# Altium project carrier.PrjPcb (part 2 of 2)

## Sheet connectors.SchDoc: DevelBoard EVA01 Main Connectors
size A3; Author: Daniele Basile <asterix@develer.com>; Organization: Develer s.r.l.; Address1: via Mugellese 1/A; Address2: 50019 Campi Bisenzio; Address3: Firenze; Address4: ITALY; DocumentNumber: 1; Revision: A; SheetNumber: 1; SheetTotal: 6
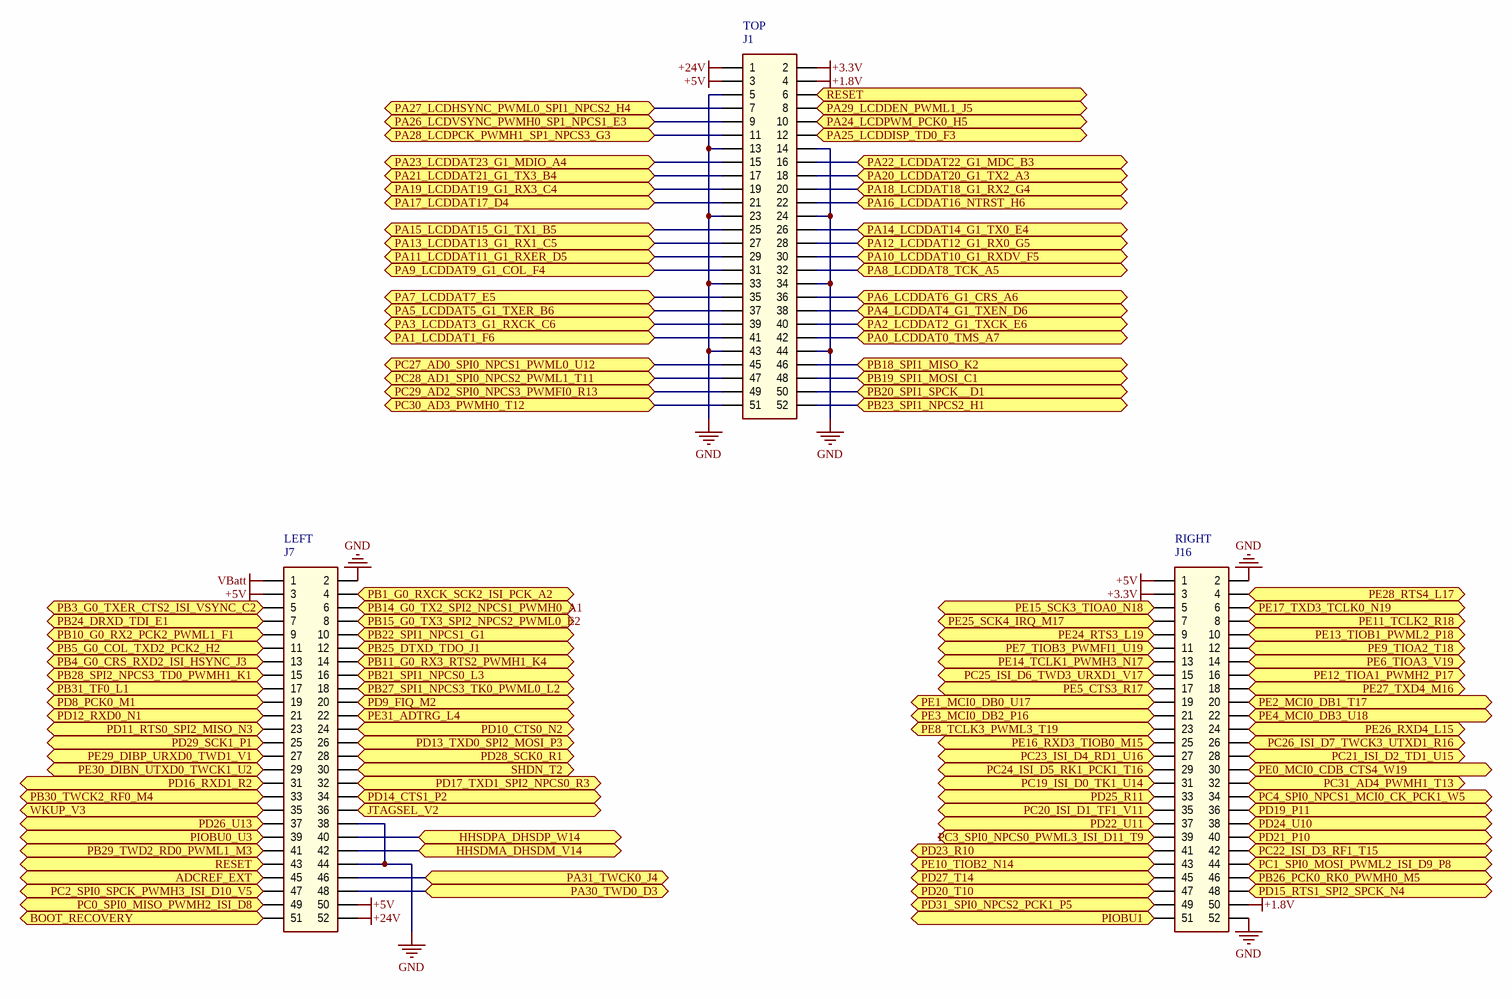
[diagram p5: connectors.SchDoc]

### Parts
J1  TOP  [HEADER_2x26_2.54MM_SMD]
J7  LEFT  [HEADER_2x26_2.54MM_SMD]
J16  RIGHT  [HEADER_2x26_2.54MM_SMD]

### Ports
ADCREF_EXT, BOOT_RECOVERY, HHSDMA_DHSDM_V14, HHSDPA_DHSDP_W14, JTAGSEL_V2, PA0_LCDDAT0_TMS_A7, PA1_LCDDAT1_F6, PA2_LCDDAT2_G1_TXCK_E6, PA3_LCDDAT3_G1_RXCK_C6, PA4_LCDDAT4_G1_TXEN_D6, PA5_LCDDAT5_G1_TXER_B6, PA6_LCDDAT6_G1_CRS_A6, PA7_LCDDAT7_E5, PA8_LCDDAT8_TCK_A5, PA9_LCDDAT9_G1_COL_F4, PA10_LCDDAT10_G1_RXDV_F5, PA11_LCDDAT11_G1_RXER_D5, PA12_LCDDAT12_G1_RX0_G5, PA13_LCDDAT13_G1_RX1_C5, PA14_LCDDAT14_G1_TX0_E4, PA15_LCDDAT15_G1_TX1_B5, PA16_LCDDAT16_NTRST_H6, PA17_LCDDAT17_D4, PA18_LCDDAT18_G1_RX2_G4, PA19_LCDDAT19_G1_RX3_C4, PA20_LCDDAT20_G1_TX2_A3, PA21_LCDDAT21_G1_TX3_B4, PA22_LCDDAT22_G1_MDC_B3, PA23_LCDDAT23_G1_MDIO_A4, PA24_LCDPWM_PCK0_H5, PA25_LCDDISP_TD0_F3, PA26_LCDVSYNC_PWMH0_SP1_NPCS1_E3, PA27_LCDHSYNC_PWML0_SPI1_NPCS2_H4, PA28_LCDPCK_PWMH1_SP1_NPCS3_G3, PA29_LCDDEN_PWML1_J5, PA30_TWD0_D3, PA31_TWCK0_J4, PB1_G0_RXCK_SCK2_ISI_PCK_A2, PB3_G0_TXER_CTS2_ISI_VSYNC_C2, PB4_G0_CRS_RXD2_ISI_HSYNC_J3, PB5_G0_COL_TXD2_PCK2_H2, PB10_G0_RX2_PCK2_PWML1_F1, PB11_G0_RX3_RTS2_PWMH1_K4, PB14_G0_TX2_SPI2_NPCS1_PWMH0_A1, PB15_G0_TX3_SPI2_NPCS2_PWML0_E2, PB18_SPI1_MISO_K2, PB19_SPI1_MOSI_C1, PB20_SPI1_SPCK__D1, PB21_SPI1_NPCS0_L3, PB22_SPI1_NPCS1_G1, PB23_SPI1_NPCS2_H1, PB24_DRXD_TDI_E1, PB25_DTXD_TDO_J1, PB26_PCK0_RK0_PWMH0_M5, PB27_SPI1_NPCS3_TK0_PWML0_L2, PB28_SPI2_NPCS3_TD0_PWMH1_K1, PB29_TWD2_RD0_PWML1_M3, PB30_TWCK2_RF0_M4, PB31_TF0_L1, PC0_SPI0_MISO_PWMH2_ISI_D8, PC1_SPI0_MOSI_PWML2_ISI_D9_P8, PC2_SPI0_SPCK_PWMH3_ISI_D10_V5, PC3_SPI0_NPCS0_PWML3_ISI_D11_T9, PC4_SPI0_NPCS1_MCI0_CK_PCK1_W5, PC19_ISI_D0_TK1_U14, PC20_ISI_D1_TF1_V11, PC21_ISI_D2_TD1_U15, PC22_ISI_D3_RF1_T15, PC23_ISI_D4_RD1_U16, PC24_ISI_D5_RK1_PCK1_T16, PC25_ISI_D6_TWD3_URXD1_V17, PC26_ISI_D7_TWCK3_UTXD1_R16, PC27_AD0_SPI0_NPCS1_PWML0_U12, PC28_AD1_SPI0_NPCS2_PWML1_T11, PC29_AD2_SPI0_NPCS3_PWMFI0_R13, PC30_AD3_PWMH0_T12, PC31_AD4_PWMH1_T13, PD8_PCK0_M1, PD9_FIQ_M2, PD10_CTS0_N2, PD11_RTS0_SPI2_MISO_N3, PD12_RXD0_N1, PD13_TXD0_SPI2_MOSI_P3, PD14_CTS1_P2, PD15_RTS1_SPI2_SPCK_N4, PD16_RXD1_R2, PD17_TXD1_SPI2_NPCS0_R3, PD19_P11, PD20_T10, PD21_P10, PD22_U11, PD23_R10, PD24_U10, PD25_R11, PD26_U13, PD27_T14, PD28_SCK0_R1, PD29_SCK1_P1, PD31_SPI0_NPCS2_PCK1_P5, PE0_MCI0_CDB_CTS4_W19, PE1_MCI0_DB0_U17, PE2_MCI0_DB1_T17, PE3_MCI0_DB2_P16, PE4_MCI0_DB3_U18, PE5_CTS3_R17, PE6_TIOA3_V19, PE7_TIOB3_PWMFI1_U19, PE8_TCLK3_PWML3_T19, PE9_TIOA2_T18, PE10_TIOB2_N14, PE11_TCLK2_R18, PE12_TIOA1_PWMH2_P17, PE13_TIOB1_PWML2_P18, PE14_TCLK1_PWMH3_N17, PE15_SCK3_TIOA0_N18, PE16_RXD3_TIOB0_M15, PE17_TXD3_TCLK0_N19, PE24_RTS3_L19, PE25_SCK4_IRQ_M17, PE26_RXD4_L15, PE27_TXD4_M16, PE28_RTS4_L17, PE29_DIBP_URXD0_TWD1_V1, PE30_DIBN_UTXD0_TWCK1_U2, PE31_ADTRG_L4, PIOBU0_U3, PIOBU1, RESET, SHDN_T2, WKUP_V3

### Nets
+1.8V: J1.4 J16.50
+3.3V: J1.2 J16.3
+5V: J1.3 J7.3 J7.50 J16.1
+24V: J1.1 J7.52
GND: J1.5 J1.13 J1.14 J1.23 J1.24 J1.33 J1.34 J1.43 J1.44 J7.2 J7.38 J7.44 J16.2 J16.52
VBatt: J7.1
ADCREF_EXT: J7.45 ; port ADCREF_EXT
BOOT_RECOVERY: J7.51 ; port BOOT_RECOVERY
JTAGSEL_V2: J7.36 ; port JTAGSEL_V2
PA0_LCDDAT0_TMS_A7: J1.42 ; port PA0_LCDDAT0_TMS_A7
PA1_LCDDAT1_F6: J1.41 ; port PA1_LCDDAT1_F6
PA2_LCDDAT2_G1_TXCK_E6: J1.40 ; port PA2_LCDDAT2_G1_TXCK_E6
PA3_LCDDAT3_G1_RXCK_C6: J1.39 ; port PA3_LCDDAT3_G1_RXCK_C6
PA4_LCDDAT4_G1_TXEN_D6: J1.38 ; port PA4_LCDDAT4_G1_TXEN_D6
PA5_LCDDAT5_G1_TXER_B6: J1.37 ; port PA5_LCDDAT5_G1_TXER_B6
PA6_LCDDAT6_G1_CRS_A6: J1.36 ; port PA6_LCDDAT6_G1_CRS_A6
PA7_LCDDAT7_E5: J1.35 ; port PA7_LCDDAT7_E5
PA8_LCDDAT8_TCK_A5: J1.32 ; port PA8_LCDDAT8_TCK_A5
PA9_LCDDAT9_G1_COL_F4: J1.31 ; port PA9_LCDDAT9_G1_COL_F4
PA10_LCDDAT10_G1_RXDV_F5: J1.30 ; port PA10_LCDDAT10_G1_RXDV_F5
PA11_LCDDAT11_G1_RXER_D5: J1.29 ; port PA11_LCDDAT11_G1_RXER_D5
PA12_LCDDAT12_G1_RX0_G5: J1.28 ; port PA12_LCDDAT12_G1_RX0_G5
PA13_LCDDAT13_G1_RX1_C5: J1.27 ; port PA13_LCDDAT13_G1_RX1_C5
PA14_LCDDAT14_G1_TX0_E4: J1.26 ; port PA14_LCDDAT14_G1_TX0_E4
PA15_LCDDAT15_G1_TX1_B5: J1.25 ; port PA15_LCDDAT15_G1_TX1_B5
PA16_LCDDAT16_NTRST_H6: J1.22 ; port PA16_LCDDAT16_NTRST_H6
PA17_LCDDAT17_D4: J1.21 ; port PA17_LCDDAT17_D4
PA18_LCDDAT18_G1_RX2_G4: J1.20 ; port PA18_LCDDAT18_G1_RX2_G4
PA19_LCDDAT19_G1_RX3_C4: J1.19 ; port PA19_LCDDAT19_G1_RX3_C4
PA20_LCDDAT20_G1_TX2_A3: J1.18 ; port PA20_LCDDAT20_G1_TX2_A3
PA21_LCDDAT21_G1_TX3_B4: J1.17 ; port PA21_LCDDAT21_G1_TX3_B4
PA22_LCDDAT22_G1_MDC_B3: J1.16 ; port PA22_LCDDAT22_G1_MDC_B3
PA23_LCDDAT23_G1_MDIO_A4: J1.15 ; port PA23_LCDDAT23_G1_MDIO_A4
PA24_LCDPWM_PCK0_H5: J1.10 ; port PA24_LCDPWM_PCK0_H5
PA25_LCDDISP_TD0_F3: J1.12 ; port PA25_LCDDISP_TD0_F3
PA26_LCDVSYNC_PWMH0_SP1_NPCS1_E3: J1.9 ; port PA26_LCDVSYNC_PWMH0_SP1_NPCS1_E3
PA27_LCDHSYNC_PWML0_SPI1_NPCS2_H4: J1.7 ; port PA27_LCDHSYNC_PWML0_SPI1_NPCS2_H4
PA28_LCDPCK_PWMH1_SP1_NPCS3_G3: J1.11 ; port PA28_LCDPCK_PWMH1_SP1_NPCS3_G3
PA29_LCDDEN_PWML1_J5: J1.8 ; port PA29_LCDDEN_PWML1_J5
PA30_TWD0_D3: J7.48 ; port PA30_TWD0_D3
PA31_TWCK0_J4: J7.46 ; port PA31_TWCK0_J4
PB1_G0_RXCK_SCK2_ISI_PCK_A2: J7.4 ; port PB1_G0_RXCK_SCK2_ISI_PCK_A2
PB3_G0_TXER_CTS2_ISI_VSYNC_C2: J7.5 ; port PB3_G0_TXER_CTS2_ISI_VSYNC_C2
PB4_G0_CRS_RXD2_ISI_HSYNC_J3: J7.13 ; port PB4_G0_CRS_RXD2_ISI_HSYNC_J3
PB5_G0_COL_TXD2_PCK2_H2: J7.11 ; port PB5_G0_COL_TXD2_PCK2_H2
PB10_G0_RX2_PCK2_PWML1_F1: J7.9 ; port PB10_G0_RX2_PCK2_PWML1_F1
PB11_G0_RX3_RTS2_PWMH1_K4: J7.14 ; port PB11_G0_RX3_RTS2_PWMH1_K4
PB14_G0_TX2_SPI2_NPCS1_PWMH0_A1: J7.6 ; port PB14_G0_TX2_SPI2_NPCS1_PWMH0_A1
PB15_G0_TX3_SPI2_NPCS2_PWML0_E2: J7.8 ; port PB15_G0_TX3_SPI2_NPCS2_PWML0_E2
PB18_SPI1_MISO_K2: J1.46 ; port PB18_SPI1_MISO_K2
PB19_SPI1_MOSI_C1: J1.48 ; port PB19_SPI1_MOSI_C1
PB20_SPI1_SPCK__D1: J1.50 ; port PB20_SPI1_SPCK__D1
PB21_SPI1_NPCS0_L3: J7.16 ; port PB21_SPI1_NPCS0_L3
PB22_SPI1_NPCS1_G1: J7.10 ; port PB22_SPI1_NPCS1_G1
PB23_SPI1_NPCS2_H1: J1.52 ; port PB23_SPI1_NPCS2_H1
PB24_DRXD_TDI_E1: J7.7 ; port PB24_DRXD_TDI_E1
PB25_DTXD_TDO_J1: J7.12 ; port PB25_DTXD_TDO_J1
PB26_PCK0_RK0_PWMH0_M5: J16.46 ; port PB26_PCK0_RK0_PWMH0_M5
PB27_SPI1_NPCS3_TK0_PWML0_L2: J7.18 ; port PB27_SPI1_NPCS3_TK0_PWML0_L2
PB28_SPI2_NPCS3_TD0_PWMH1_K1: J7.15 ; port PB28_SPI2_NPCS3_TD0_PWMH1_K1
PB29_TWD2_RD0_PWML1_M3: J7.41 ; port PB29_TWD2_RD0_PWML1_M3
PB30_TWCK2_RF0_M4: J7.33 ; port PB30_TWCK2_RF0_M4
PB31_TF0_L1: J7.17 ; port PB31_TF0_L1
PC0_SPI0_MISO_PWMH2_ISI_D8: J7.49 ; port PC0_SPI0_MISO_PWMH2_ISI_D8
PC1_SPI0_MOSI_PWML2_ISI_D9_P8: J16.44 ; port PC1_SPI0_MOSI_PWML2_ISI_D9_P8
PC2_SPI0_SPCK_PWMH3_ISI_D10_V5: J7.47 ; port PC2_SPI0_SPCK_PWMH3_ISI_D10_V5
PC3_SPI0_NPCS0_PWML3_ISI_D11_T9: J16.39 ; port PC3_SPI0_NPCS0_PWML3_ISI_D11_T9
PC4_SPI0_NPCS1_MCI0_CK_PCK1_W5: J16.34 ; port PC4_SPI0_NPCS1_MCI0_CK_PCK1_W5
PC19_ISI_D0_TK1_U14: J16.31 ; port PC19_ISI_D0_TK1_U14
PC20_ISI_D1_TF1_V11: J16.35 ; port PC20_ISI_D1_TF1_V11
PC21_ISI_D2_TD1_U15: J16.28 ; port PC21_ISI_D2_TD1_U15
PC22_ISI_D3_RF1_T15: J16.42 ; port PC22_ISI_D3_RF1_T15
PC23_ISI_D4_RD1_U16: J16.27 ; port PC23_ISI_D4_RD1_U16
PC24_ISI_D5_RK1_PCK1_T16: J16.29 ; port PC24_ISI_D5_RK1_PCK1_T16
PC25_ISI_D6_TWD3_URXD1_V17: J16.15 ; port PC25_ISI_D6_TWD3_URXD1_V17
PC26_ISI_D7_TWCK3_UTXD1_R16: J16.26 ; port PC26_ISI_D7_TWCK3_UTXD1_R16
PC27_AD0_SPI0_NPCS1_PWML0_U12: J1.45 ; port PC27_AD0_SPI0_NPCS1_PWML0_U12
PC28_AD1_SPI0_NPCS2_PWML1_T11: J1.47 ; port PC28_AD1_SPI0_NPCS2_PWML1_T11
PC29_AD2_SPI0_NPCS3_PWMFI0_R13: J1.49 ; port PC29_AD2_SPI0_NPCS3_PWMFI0_R13
PC30_AD3_PWMH0_T12: J1.51 ; port PC30_AD3_PWMH0_T12
PC31_AD4_PWMH1_T13: J16.32 ; port PC31_AD4_PWMH1_T13
PD8_PCK0_M1: J7.19 ; port PD8_PCK0_M1
PD9_FIQ_M2: J7.20 ; port PD9_FIQ_M2
PD10_CTS0_N2: J7.24 ; port PD10_CTS0_N2
PD11_RTS0_SPI2_MISO_N3: J7.23 ; port PD11_RTS0_SPI2_MISO_N3
PD12_RXD0_N1: J7.21 ; port PD12_RXD0_N1
PD13_TXD0_SPI2_MOSI_P3: J7.26 ; port PD13_TXD0_SPI2_MOSI_P3
PD14_CTS1_P2: J7.34 ; port PD14_CTS1_P2
PD15_RTS1_SPI2_SPCK_N4: J16.48 ; port PD15_RTS1_SPI2_SPCK_N4
PD16_RXD1_R2: J7.31 ; port PD16_RXD1_R2
PD17_TXD1_SPI2_NPCS0_R3: J7.32 ; port PD17_TXD1_SPI2_NPCS0_R3
PD19_P11: J16.36 ; port PD19_P11
PD20_T10: J16.47 ; port PD20_T10
PD21_P10: J16.40 ; port PD21_P10
PD22_U11: J16.37 ; port PD22_U11
PD23_R10: J16.41 ; port PD23_R10
PD24_U10: J16.38 ; port PD24_U10
PD25_R11: J16.33 ; port PD25_R11
PD26_U13: J7.37 ; port PD26_U13
PD27_T14: J16.45 ; port PD27_T14
PD28_SCK0_R1: J7.28 ; port PD28_SCK0_R1
PD29_SCK1_P1: J7.25 ; port PD29_SCK1_P1
PD31_SPI0_NPCS2_PCK1_P5: J16.49 ; port PD31_SPI0_NPCS2_PCK1_P5
PE0_MCI0_CDB_CTS4_W19: J16.30 ; port PE0_MCI0_CDB_CTS4_W19
PE1_MCI0_DB0_U17: J16.19 ; port PE1_MCI0_DB0_U17
PE2_MCI0_DB1_T17: J16.20 ; port PE2_MCI0_DB1_T17
PE3_MCI0_DB2_P16: J16.21 ; port PE3_MCI0_DB2_P16
PE4_MCI0_DB3_U18: J16.22 ; port PE4_MCI0_DB3_U18
PE5_CTS3_R17: J16.17 ; port PE5_CTS3_R17
PE6_TIOA3_V19: J16.14 ; port PE6_TIOA3_V19
PE7_TIOB3_PWMFI1_U19: J16.11 ; port PE7_TIOB3_PWMFI1_U19
PE8_TCLK3_PWML3_T19: J16.23 ; port PE8_TCLK3_PWML3_T19
PE9_TIOA2_T18: J16.12 ; port PE9_TIOA2_T18
PE10_TIOB2_N14: J16.43 ; port PE10_TIOB2_N14
PE11_TCLK2_R18: J16.8 ; port PE11_TCLK2_R18
PE12_TIOA1_PWMH2_P17: J16.16 ; port PE12_TIOA1_PWMH2_P17
PE13_TIOB1_PWML2_P18: J16.10 ; port PE13_TIOB1_PWML2_P18
PE14_TCLK1_PWMH3_N17: J16.13 ; port PE14_TCLK1_PWMH3_N17
PE15_SCK3_TIOA0_N18: J16.5 ; port PE15_SCK3_TIOA0_N18
PE16_RXD3_TIOB0_M15: J16.25 ; port PE16_RXD3_TIOB0_M15
PE17_TXD3_TCLK0_N19: J16.6 ; port PE17_TXD3_TCLK0_N19
PE24_RTS3_L19: J16.9 ; port PE24_RTS3_L19
PE25_SCK4_IRQ_M17: J16.7 ; port PE25_SCK4_IRQ_M17
PE26_RXD4_L15: J16.24 ; port PE26_RXD4_L15
PE27_TXD4_M16: J16.18 ; port PE27_TXD4_M16
PE28_RTS4_L17: J16.4 ; port PE28_RTS4_L17
PE29_DIBP_URXD0_TWD1_V1: J7.27 ; port PE29_DIBP_URXD0_TWD1_V1
PE30_DIBN_UTXD0_TWCK1_U2: J7.29 ; port PE30_DIBN_UTXD0_TWCK1_U2
PE31_ADTRG_L4: J7.22 ; port PE31_ADTRG_L4
PIOBU0_U3: J7.39 ; port PIOBU0_U3
PIOBU1: J16.51 ; port PIOBU1
RESET: J1.6 J7.43 ; port RESET
SHDN_T2: J7.30 ; port SHDN_T2
usb_otg_n: J7.42 ; port HHSDMA_DHSDM_V14
usb_otg_p: J7.40 ; port HHSDPA_DHSDP_W14
WKUP_V3: J7.35 ; port WKUP_V3

### Notes on the sheet
- Title:
- Author:
- License:
- BSD
- Rev:
- Size:
- A3
- File:
- Date:
- Time:
- Sheet
- of

### Library data of the parts
J1 J7 J16 = Header 26x2: Pin header 26x2; Part Number: Tyco 1-1634688; Purchase Code: RS 473-8254

## Nets that join several sheets
+1.8V: supply (D17.1 L16.1 Tp4.1), wifi (17 pins), connectors (J1.4 J16.50)
+3.3V: supply (D5.1 L12.1 L15.1 Tp9.1), wifi (9 pins), develboard (L1.1), usb_ethernet (5 pins), sd_debug (C23.1 J10.4 L7.1), connectors (J1.2 J16.3)
+5V: supply (D4.1 D6.1 L5.1 Tp10.1), usb_ethernet (C28.1 U5.7), sd_debug (P?#2.2), connectors (J1.3 J7.3 J7.50 J16.1)
+24V: supply (6 pins), connectors (J1.1 J7.52)
GND: supply (36 pins), wifi (62 pins), develboard (11 pins), usb_ethernet (16 pins), sd_debug (21 pins), connectors (14 pins)
SHLD: usb_ethernet (J13.8 J13.15 J13.16 L21.1), sd_debug (9 pins)
VBatt: supply (5 pins), develboard (U1.126), connectors (J7.1)
VCC_USB: supply (D8.1 Tp16.1), sd_debug (6 pins)
ADCREF_EXT: develboard (U1.150), connectors (J7.45)
BOOT_RECOVERY: develboard (U1.152), connectors (J7.51)
ETH_LEDACTLINK: develboard (U1.77), usb_ethernet (J13.12)
ETH_LEDSPEED: develboard (U1.76), usb_ethernet (J13.10)
ETHRX_N: develboard (U1.78), usb_ethernet (J13.6)
ETHRX_P: develboard (U1.79), usb_ethernet (J13.3)
ETHTX_N: develboard (U1.80), usb_ethernet (J13.2)
ETHTX_P: develboard (U1.81), usb_ethernet (J13.1)
JTAGSEL_V2: develboard (U1.131), connectors (J7.36)
PA0_LCDDAT0_TMS_A7: develboard (U1.61), connectors (J1.42)
PA1_LCDDAT1_F6: develboard (U1.51), connectors (J1.41)
PA2_LCDDAT2_G1_TXCK_E6: develboard (U1.53), connectors (J1.40)
PA3_LCDDAT3_G1_RXCK_C6: develboard (U1.57), connectors (J1.39)
PA4_LCDDAT4_G1_TXEN_D6: develboard (U1.55), connectors (J1.38)
PA5_LCDDAT5_G1_TXER_B6: develboard (U1.59), connectors (J1.37)
PA6_LCDDAT6_G1_CRS_A6: develboard (U1.62), connectors (J1.36)
PA7_LCDDAT7_E5: develboard (U1.50), connectors (J1.35)
PA8_LCDDAT8_TCK_A5: develboard (U1.65), connectors (J1.32)
PA9_LCDDAT9_G1_COL_F4: develboard (U1.72), connectors (J1.31)
PA10_LCDDAT10_G1_RXDV_F5: develboard (U1.49), connectors (J1.30)
PA11_LCDDAT11_G1_RXER_D5: develboard (U1.54), connectors (J1.29)
PA12_LCDDAT12_G1_RX0_G5: develboard (U1.47), connectors (J1.28)
PA13_LCDDAT13_G1_RX1_C5: develboard (U1.58), connectors (J1.27)
PA14_LCDDAT14_G1_TX0_E4: develboard (U1.52), connectors (J1.26)
PA15_LCDDAT15_G1_TX1_B5: develboard (U1.60), connectors (J1.25)
PA16_LCDDAT16_NTRST_H6: develboard (U1.48), connectors (J1.22)
PA17_LCDDAT17_D4: develboard (U1.71), connectors (J1.21)
PA18_LCDDAT18_G1_RX2_G4: develboard (U1.75), connectors (J1.20)
PA19_LCDDAT19_G1_RX3_C4: develboard (U1.68), connectors (J1.19)
PA20_LCDDAT20_G1_TX2_A3: develboard (U1.69), connectors (J1.18)
PA21_LCDDAT21_G1_TX3_B4: develboard (U1.66), connectors (J1.17)
PA22_LCDDAT22_G1_MDC_B3: develboard (U1.70), connectors (J1.16)
PA23_LCDDAT23_G1_MDIO_A4: develboard (U1.67), connectors (J1.15)
PA24_LCDPWM_PCK0_H5: develboard (U1.45), connectors (J1.10)
PA25_LCDDISP_TD0_F3: develboard (U1.73), connectors (J1.12)
PA26_LCDVSYNC_PWMH0_SP1_NPCS1_E3: develboard (U1.56), connectors (J1.9)
PA27_LCDHSYNC_PWML0_SPI1_NPCS2_H4: develboard (U1.44), connectors (J1.7)
PA28_LCDPCK_PWMH1_SP1_NPCS3_G3: develboard (U1.74), connectors (J1.11)
PA29_LCDDEN_PWML1_J5: develboard (U1.46), connectors (J1.8)
PA30_TWD0_D3: develboard (U1.140), connectors (J7.48)
PA31_TWCK0_J4: develboard (U1.139), connectors (J7.46)
PB1_G0_RXCK_SCK2_ISI_PCK_A2: develboard (U1.93), connectors (J7.4)
PB3_G0_TXER_CTS2_ISI_VSYNC_C2: develboard (U1.94), connectors (J7.5)
PB4_G0_CRS_RXD2_ISI_HSYNC_J3: develboard (U1.107), connectors (J7.13)
PB5_G0_COL_TXD2_PCK2_H2: develboard (U1.102), connectors (J7.11)
PB10_G0_RX2_PCK2_PWML1_F1: develboard (U1.100), connectors (J7.9)
PB11_G0_RX3_RTS2_PWMH1_K4: develboard (U1.108), connectors (J7.14)
PB14_G0_TX2_SPI2_NPCS1_PWMH0_A1: develboard (U1.97), connectors (J7.6)
PB15_G0_TX3_SPI2_NPCS2_PWML0_E2: develboard (U1.99), connectors (J7.8)
PB18_SPI1_MISO_K2: develboard (U1.110), connectors (J1.46)
PB19_SPI1_MOSI_C1: develboard (U1.95), connectors (J1.48)
PB20_SPI1_SPCK__D1: develboard (U1.96), connectors (J1.50)
PB21_SPI1_NPCS0_L3: develboard (U1.111), connectors (J7.16)
PB22_SPI1_NPCS1_G1: develboard (U1.101), connectors (J7.10)
PB23_SPI1_NPCS2_H1: develboard (U1.103), connectors (J1.52)
PB24_DRXD_TDI_E1: develboard (U1.98), connectors (J7.7)
PB25_DTXD_TDO_J1: develboard (U1.104), connectors (J7.12)
PB26_PCK0_RK0_PWMH0_M5: develboard (U1.157), connectors (J16.46)
PB27_SPI1_NPCS3_TK0_PWML0_L2: develboard (U1.113), connectors (J7.18)
PB28_SPI2_NPCS3_TD0_PWMH1_K1: develboard (U1.109), connectors (J7.15)
PB29_TWD2_RD0_PWML1_M3: wifi (R62.1), develboard (U1.137), connectors (J7.41)
PB30_TWCK2_RF0_M4: wifi (R?#1.1), develboard (U1.129), connectors (J7.33)
PB31_TF0_L1: develboard (U1.112), connectors (J7.17)
PC0_SPI0_MISO_PWMH2_ISI_D8: develboard (U1.153), connectors (J7.49)
PC1_SPI0_MOSI_PWML2_ISI_D9_P8: develboard (U1.159), connectors (J16.44)
PC2_SPI0_SPCK_PWMH3_ISI_D10_V5: develboard (U1.151), connectors (J7.47)
PC3_SPI0_NPCS0_PWML3_ISI_D11_T9: develboard (U1.2), connectors (J16.39)
PC4_SPI0_NPCS1_MCI0_CK_PCK1_W5: wifi (R6.2), connectors (J16.34)
PC4_SPI0_NPCS1_MCI0_CK_PCK1_W5_INT: wifi (R6.1 R84.2), develboard (U1.138)
PC19_ISI_D0_TK1_U14: develboard (U1.7), connectors (J16.31)
PC20_ISI_D1_TF1_V11: develboard (U1.3), connectors (J16.35)
PC21_ISI_D2_TD1_U15: develboard (U1.8), connectors (J16.28)
PC22_ISI_D3_RF1_T15: develboard (U1.161), connectors (J16.42)
PC23_ISI_D4_RD1_U16: develboard (U1.10), connectors (J16.27)
PC24_ISI_D5_RK1_PCK1_T16: develboard (U1.9), connectors (J16.29)
PC25_ISI_D6_TWD3_URXD1_V17: develboard (U1.25), connectors (J16.15)
PC26_ISI_D7_TWCK3_UTXD1_R16: develboard (U1.11), connectors (J16.26)
PC27_AD0_SPI0_NPCS1_PWML0_U12: develboard (U1.136), connectors (J1.45)
PC28_AD1_SPI0_NPCS2_PWML1_T11: develboard (U1.134), connectors (J1.47)
PC29_AD2_SPI0_NPCS3_PWMFI0_R13: develboard (U1.16), connectors (J1.49)
PC30_AD3_PWMH0_T12: develboard (U1.1), connectors (J1.51)
PC31_AD4_PWMH1_T13: develboard (U1.6), connectors (J16.32)
PD8_PCK0_M1: develboard (U1.114), connectors (J7.19)
PD9_FIQ_M2: develboard (U1.115), connectors (J7.20)
PD10_CTS0_N2: develboard (U1.118), connectors (J7.24)
PD11_RTS0_SPI2_MISO_N3: develboard (U1.119), connectors (J7.23)
PD12_RXD0_N1: develboard (U1.117), connectors (J7.21)
PD13_TXD0_SPI2_MOSI_P3: develboard (U1.120), connectors (J7.26)
PD14_CTS1_P2: wifi (R60.1), develboard (U1.130), connectors (J7.34)
PD15_RTS1_SPI2_SPCK_N4: wifi (R57.1), develboard (U1.155), connectors (J16.48)
PD16_RXD1_R2: wifi (R59.1), develboard (U1.127), connectors (J7.31)
PD17_TXD1_SPI2_NPCS0_R3: wifi (R58.1), develboard (U1.128), connectors (J7.32)
PD19_P11: develboard (U1.168), connectors (J16.36)
PD20_T10: develboard (U1.158), connectors (J16.47)
PD21_P10: develboard (U1.165), connectors (J16.40)
PD22_U11: develboard (U1.4), connectors (J16.37)
PD23_R10: develboard (U1.166), connectors (J16.41)
PD24_U10: develboard (U1.167), connectors (J16.38)
PD25_R11: develboard (U1.5), connectors (J16.33)
PD26_U13: wifi (R86.2 R?#2.1), develboard (U1.133), connectors (J7.37)
PD27_T14: develboard (U1.160), connectors (J16.45)
PD28_SCK0_R1: develboard (U1.122), connectors (J7.28)
PD29_SCK1_P1: develboard (U1.121), connectors (J7.25)
PD31_SPI0_NPCS2_PCK1_P5: develboard (U1.156), connectors (J16.49)
PE0_MCI0_CDB_CTS4_W19: wifi (R7.2), connectors (J16.30)
PE0_MCI0_CDB_CTS4_W19_INT: wifi (R7.1 R85.2), develboard (U1.28)
PE1_MCI0_DB0_U17: wifi (R5.2), connectors (J16.19)
PE1_MCI0_DB0_U17_INT: wifi (R5.1 R83.2), develboard (U1.23)
PE2_MCI0_DB1_T17: wifi (R4.2), connectors (J16.20)
PE2_MCI0_DB1_T17_INT: wifi (R4.1 R82.2), develboard (U1.26)
PE3_MCI0_DB2_P16: wifi (R3.2), connectors (J16.21)
PE3_MCI0_DB2_P16_INT: wifi (R3.1 R81.2), develboard (U1.12)
PE4_MCI0_DB3_U18: wifi (R2.2), connectors (J16.22)
PE4_MCI0_DB3_U18_INT: wifi (R2.1 R80.2), develboard (U1.19)
PE5_CTS3_R17: develboard (U1.20), connectors (J16.17)
PE6_TIOA3_V19: develboard (U1.30), connectors (J16.14)
PE7_TIOB3_PWMFI1_U19: develboard (U1.31), connectors (J16.11)
PE8_TCLK3_PWML3_T19: wifi (R1.2), connectors (J16.23)
PE8_TCLK3_PWML3_T19_INT: wifi (R1.1 R79.2), develboard (U1.24)
PE9_TIOA2_T18: develboard (U1.32), connectors (J16.12)
PE10_TIOB2_N14: develboard (U1.164), connectors (J16.43)
PE11_TCLK2_R18: develboard (U1.36), usb_ethernet (R51.1), connectors (J16.8)
PE12_TIOA1_PWMH2_P17: develboard (U1.27), usb_ethernet (R52.1), connectors (J16.16)
PE13_TIOB1_PWML2_P18: develboard (U1.34), connectors (J16.10)
PE14_TCLK1_PWMH3_N17: develboard (U1.29), usb_ethernet (R54.1), connectors (J16.13)
PE15_SCK3_TIOA0_N18: develboard (U1.39), connectors (J16.5)
PE16_RXD3_TIOB0_M15: develboard (U1.14), sd_debug (R37.1), connectors (J16.25)
PE17_TXD3_TCLK0_N19: develboard (U1.38), sd_debug (R38.1), connectors (J16.6)
PE18_TIOA5_MCI1_CK_P19: develboard (U1.35), sd_debug (R46.1)
PE19_TIOB5_MCI1_CDA_N16: develboard (U1.18), sd_debug (R47.1)
PE20_TCLK5_MCI1_DA0_M14: develboard (U1.13), sd_debug (R45.1)
PE21_TIOA4_MCI1_DA1_M18: develboard (U1.41), sd_debug (R44.1)
PE22_TIOB4_MCI1_DA2_M19: develboard (U1.40), sd_debug (R49.1)
PE23_TCLK4_MCI_DA3_L18: develboard (U1.43), sd_debug (R48.1)
PE24_RTS3_L19: develboard (U1.33), connectors (J16.9)
PE25_SCK4_IRQ_M17: develboard (U1.37), connectors (J16.7)
PE26_RXD4_L15: develboard (U1.15), connectors (J16.24)
PE27_TXD4_M16: develboard (U1.17), connectors (J16.18)
PE28_RTS4_L17: develboard (U1.42), connectors (J16.4)
PE29_DIBP_URXD0_TWD1_V1: develboard (U1.123), connectors (J7.27)
PE30_DIBN_UTXD0_TWCK1_U2: develboard (U1.125), connectors (J7.29)
PE31_ADTRG_L4: develboard (U1.116), connectors (J7.22)
PIOBU0_U3: develboard (U1.135), connectors (J7.39)
PIOBU1: develboard (U1.154), connectors (J16.51)
RESET: develboard (U1.149), sd_debug (R33.2), connectors (J1.6 J7.43)
SHDN_T2: develboard (U1.124), connectors (J7.30)
usb1_n: develboard (U1.143), usb_ethernet (L10.1)
usb1_p: develboard (U1.144), usb_ethernet (L10.4)
usb2_n: develboard (U1.146), usb_ethernet (L11.1)
usb2_p: develboard (U1.145), usb_ethernet (L11.4)
usb_otg_n: develboard (U1.141), connectors (J7.42)
usb_otg_p: develboard (U1.142), connectors (J7.40)
WKUP_V3: develboard (U1.132), connectors (J7.35)